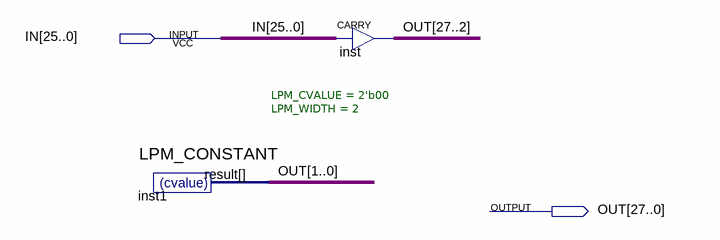
[diagram p0: schematic sheet]
// Quartus schematic twentysixleftshift.bdf as structural Verilog: 2 symbols, 2 pins
module twentysixleftshift (
  input  [25:0] IN,
  output [27:0] OUT
);

  LPM_CONSTANT #(.LPM_CVALUE(2'b00), .LPM_WIDTH(2)) inst1 (.result(OUT[1:0]));
  CARRY inst[25:0] (.IN(IN), .OUT(OUT[27:2]));
endmodule
